# Altium schematic sheet schematic1.SchDoc
size A2; SheetNumber: 5; SheetTotal: 5
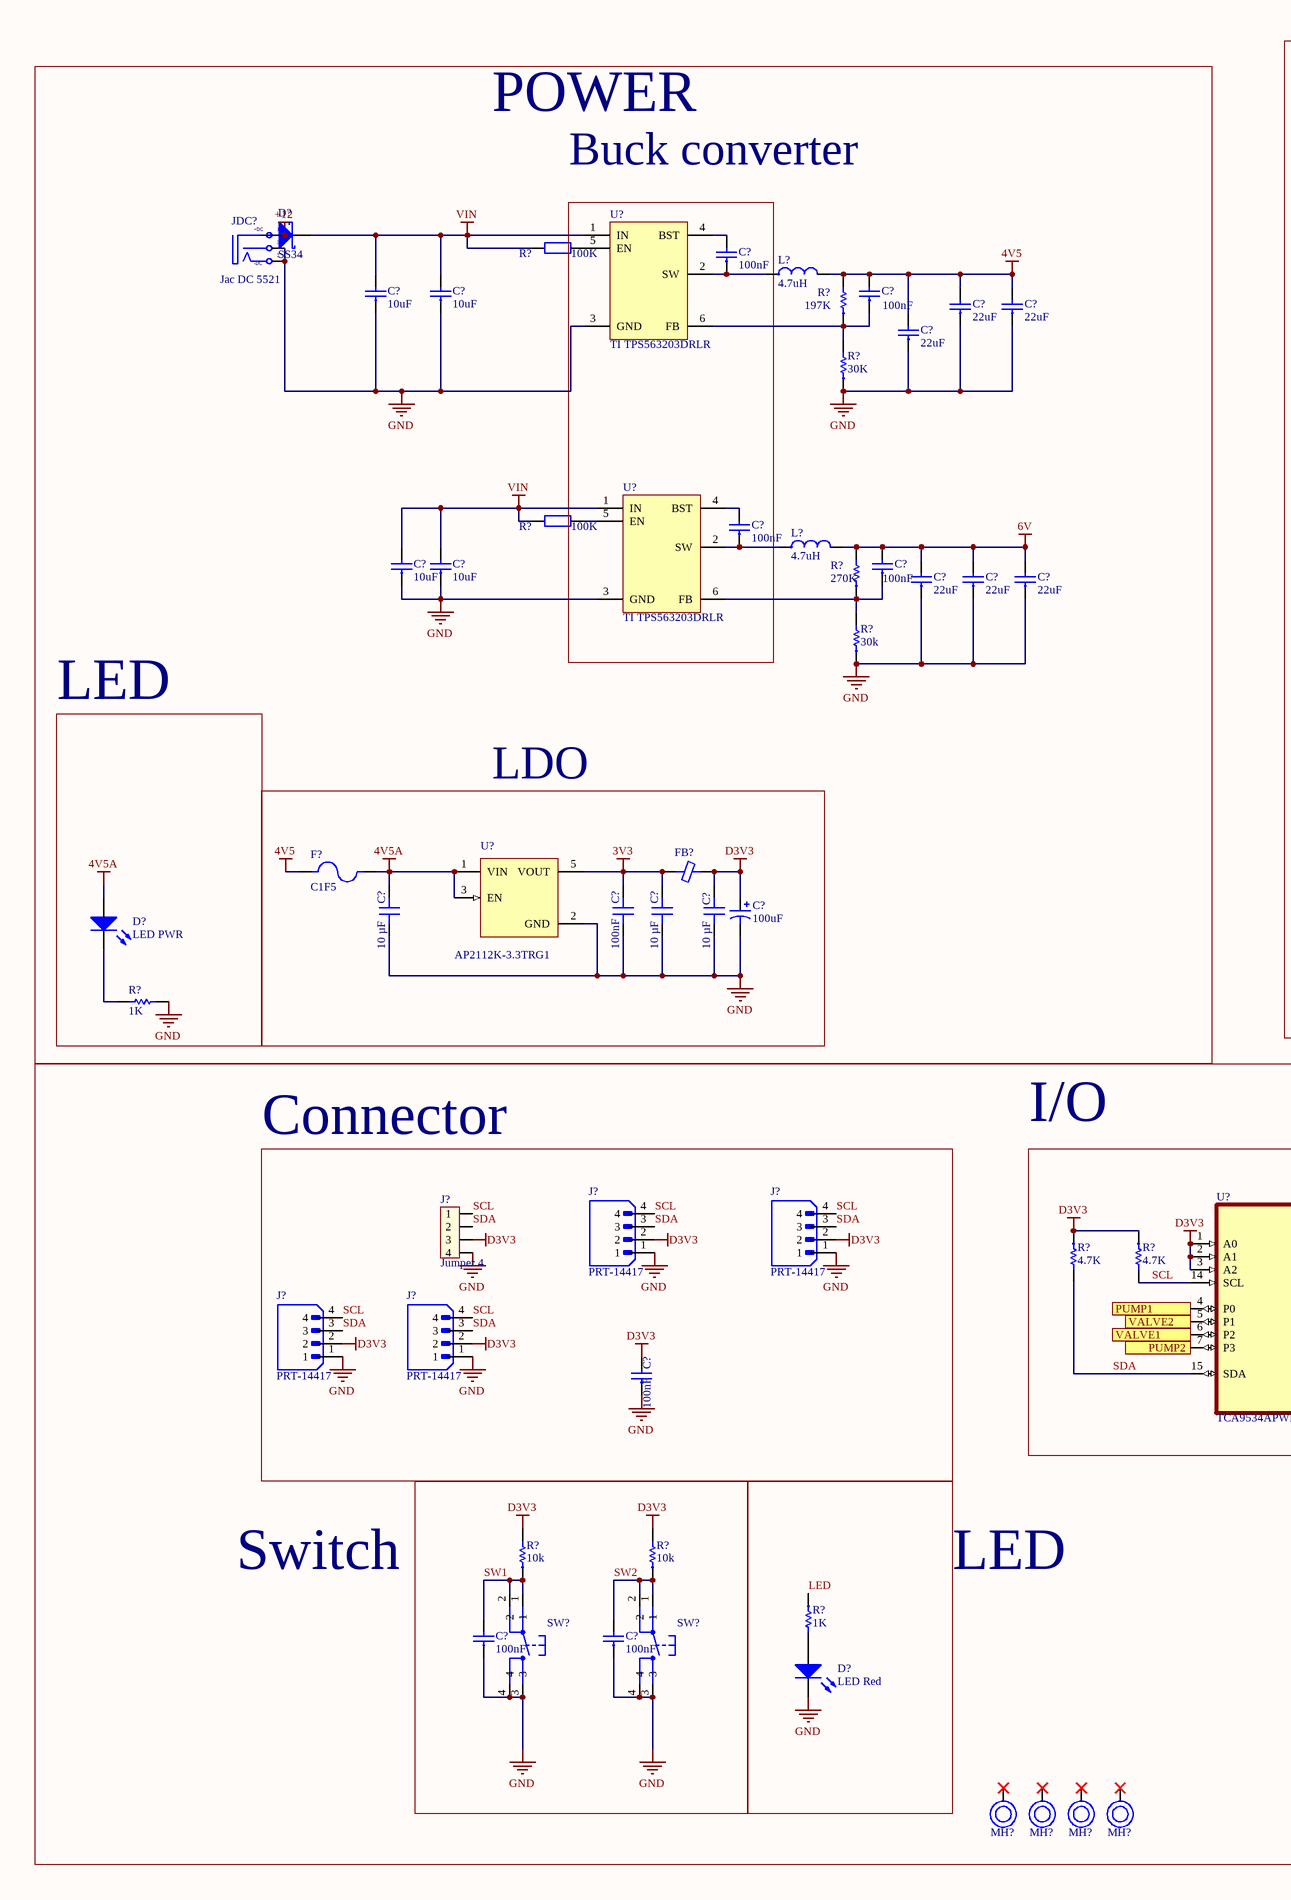
[diagram p0: schematic1.SchDoc, left]
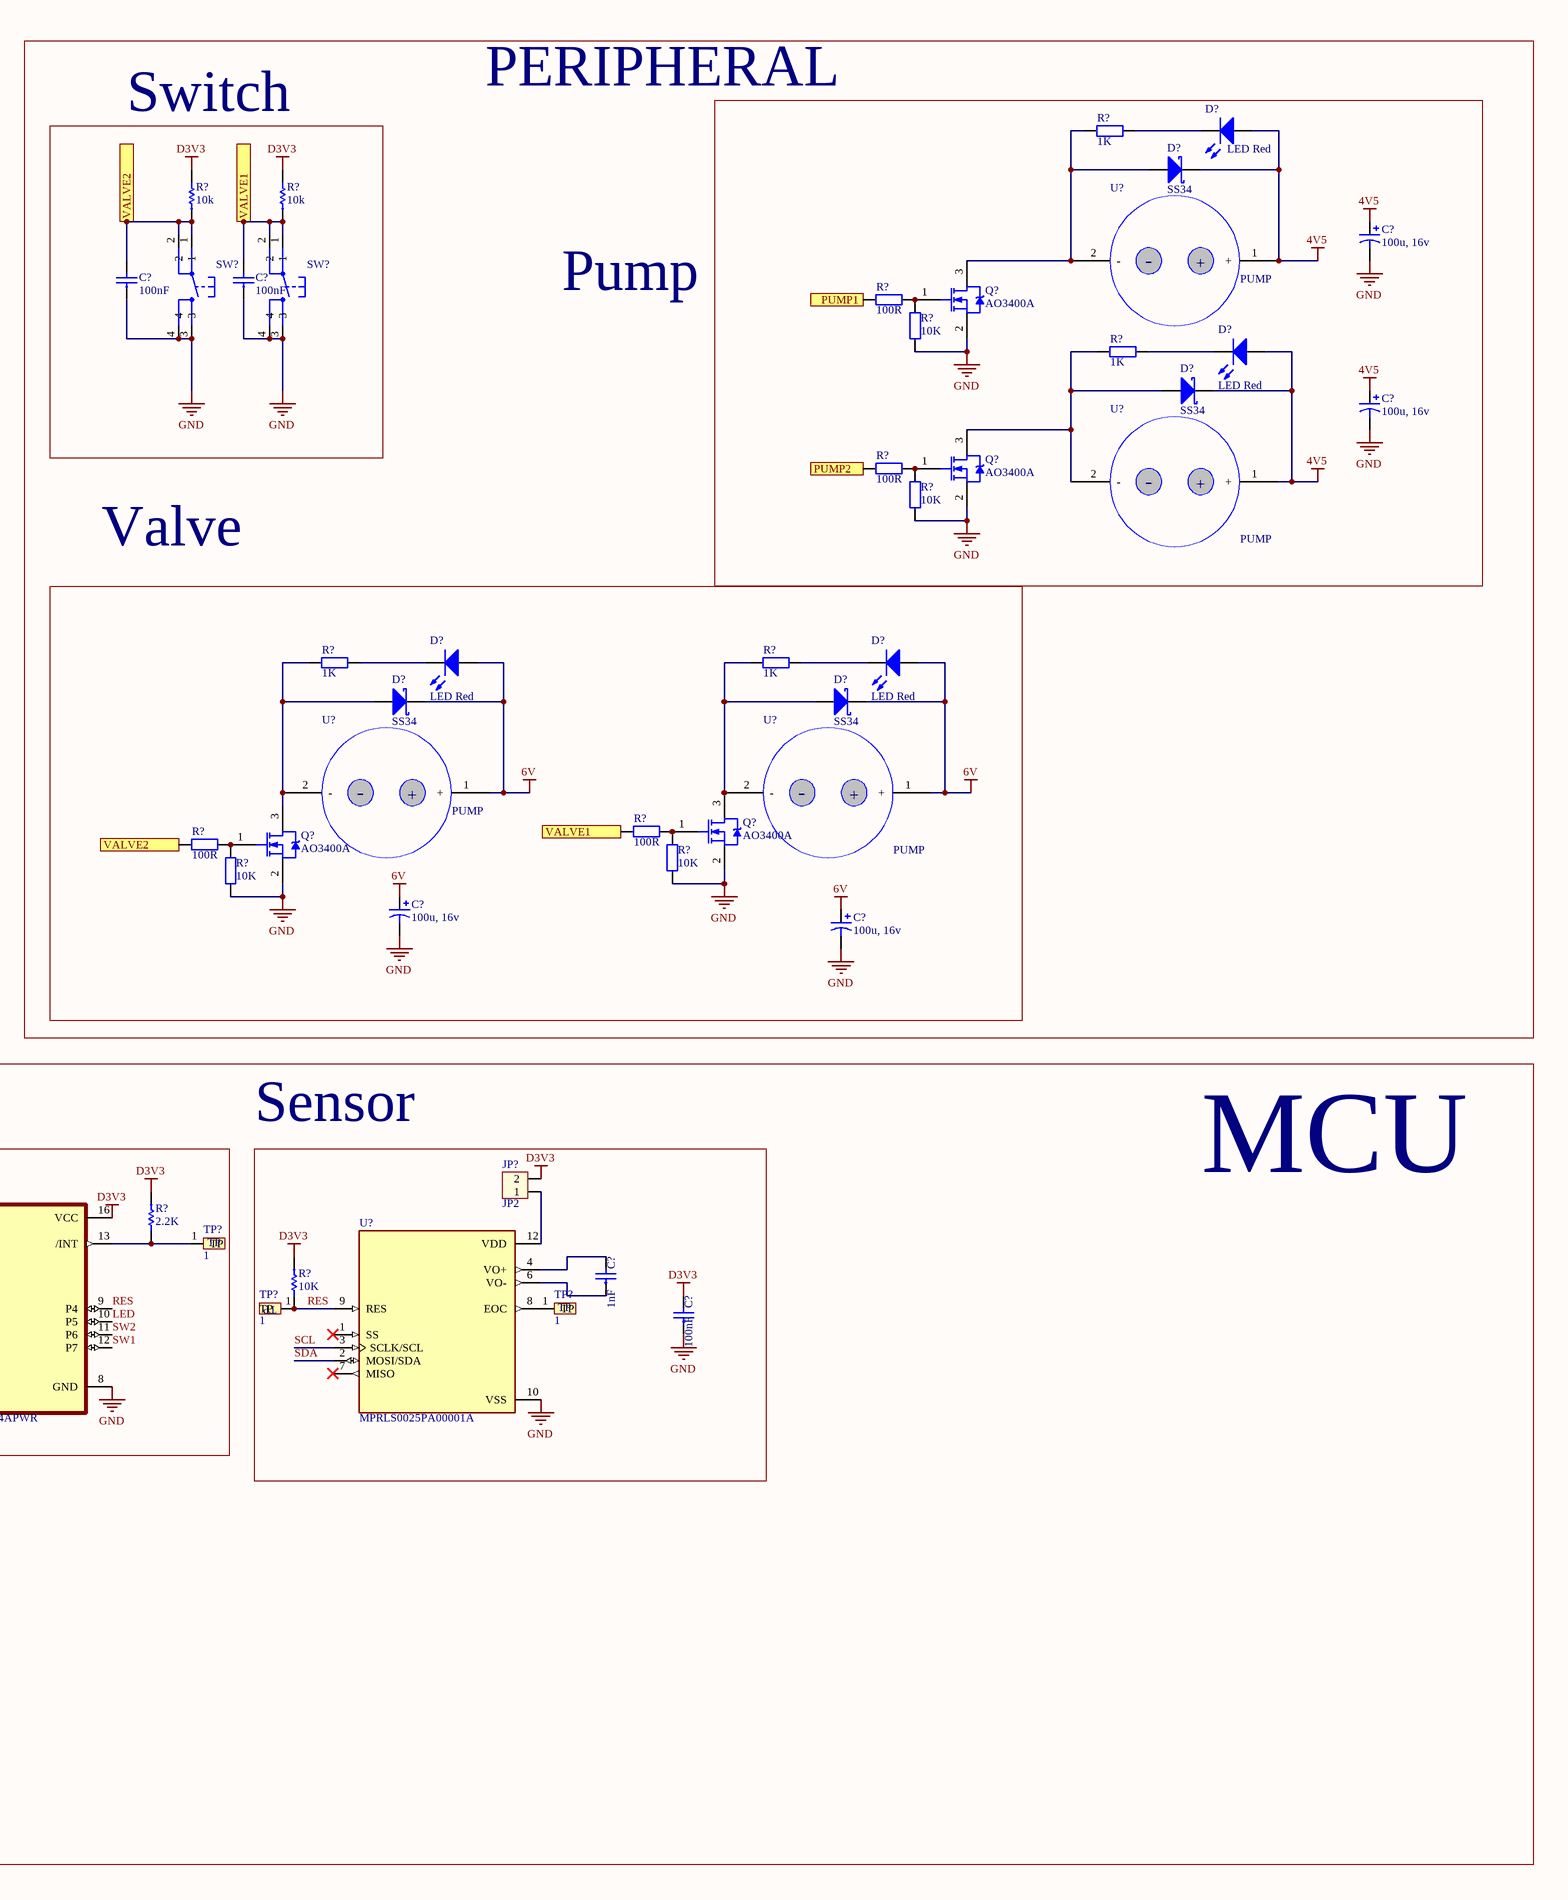
[diagram p1: schematic1.SchDoc, right]

## Parts
(Parts that share a designator on the sheet are numbered #1, #2 ... from top to bottom, then left to right.)
C?#1  value 100u, 16v  [CAPACITOR SIZE_D(D6.6)]  (hidden comment: CAP ALUM 100UF 20% 16V SMD)
C?#2  100nF  [C0603]
C?#3  100nF  [C0603]
C?#4  100nF  [C0603]
C?#5  10uF  [CN-SMD-0603]
C?#6  10uF  [CN-SMD-0603]
C?#7  100nF  [C0603]
C?#8  22uF  [CN-SMD-0603]
C?#9  22uF  [CN-SMD-0603]
C?#10  22uF  [CN-SMD-0603]
C?#11  value 100u, 16v  [CAPACITOR SIZE_D(D6.6)]  (hidden comment: CAP ALUM 100UF 20% 16V SMD)
C?#12  100nF  [C0603]
C?#13  10uF  [CN-SMD-0603]
C?#14  10uF  [CN-SMD-0603]
C?#15  100nF  [C0603]
C?#16  22uF  [CN-SMD-0603]
C?#17  22uF  [CN-SMD-0603]
C?#18  22uF  [CN-SMD-0603]
C?#19  value 100u, 16v  [CAPACITOR SIZE_D(D6.6)]  (hidden comment: CAP ALUM 100UF 20% 16V SMD)
C?#20  10 µF  [C0603]
C?#21  100nF  [C0603]
C?#22  10 µF  [C0603]
C?#23  10 µF  [C0603]
C?#24  value 100uF  [CAPACITOR SIZE_D(D6.6)]  (hidden comment: CAP ALUM 100UF 20% 16V SMD)
C?#25  value 100u, 16v  [CAPACITOR SIZE_D(D6.6)]  (hidden comment: CAP ALUM 100UF 20% 16V SMD)
C?#26  1nF  [C0603]
C?#27  100nF  [C0603]
C?#28  100nF  [C0603]
C?#29  100nF  [C0603]
C?#30  100nF  [C0603]
D?#1  LED Red  [LED0603-R]
D?#2  SS34  [DO-214AC]
D?#3  SS34  [DO-214AC]
D?#4  LED Red  [LED0603-R]
D?#5  SS34  [DO-214AC]
D?#6  LED Red  [LED0603-R]
D?#7  LED Red  [LED0603-R]
D?#8  SS34  [DO-214AC]
D?#9  SS34  [DO-214AC]
D?#10  value LED PWR  [LED0603-R]  (hidden comment: LED Red)
D?#11  LED Red  [LED0603-R]
F?  C1F5  [FUSE C1F5]
FB?  330 Ohms @ 100 MHz  [L0603]  (value not drawn)
J?#1  Jumper 4  [JP4]
J?#2  PRT-14417  [SPARKFUN_PRT-14417]
J?#3  PRT-14417  [SPARKFUN_PRT-14417]
J?#4  PRT-14417  [SPARKFUN_PRT-14417]
J?#5  PRT-14417  [SPARKFUN_PRT-14417]
JDC?  Jac DC 5521  [DC0]
JP?  JP2  [CON2]
L?#1  4.7uH  [IND-0420-2R2]
L?#2  4.7uH  [IND-0420-2R2]
MH?#1  MOUNTING HOLE  [M3]  (value not drawn)
MH?#2  MOUNTING HOLE  [M3]  (value not drawn)
MH?#3  MOUNTING HOLE  [M3]  (value not drawn)
MH?#4  MOUNTING HOLE  [M3]  (value not drawn)
Q?#1  AO3400A  [SOT-23]
Q?#2  AO3400A  [SOT-23]
Q?#3  AO3400A  [SOT-23]
Q?#4  AO3400A  [SOT-23]
R?#1  value 1K  [R0603]  (hidden comment: RES 1K 5% 1/10W 0603)
R?#2  10k  [R0603]
R?#3  10k  [R0603]
R?#4  value 100K  [R0603]  (hidden comment: RES 100K 5% 1/10W 0603)
R?#5  value 100R  [R0603]  (hidden comment: RES 100R 5% 1/10W 0603)
R?#6  197K  [R0603]
R?#7  value 10K  [R0603]  (hidden comment: RES 10K 5% 1/10W 0603)
R?#8  value 1K  [R0603]  (hidden comment: RES 1K 5% 1/10W 0603)
R?#9  30K  [R0603]
R?#10  value 100R  [R0603]  (hidden comment: RES 100R 5% 1/10W 0603)
R?#11  value 10K  [R0603]  (hidden comment: RES 10K 5% 1/10W 0603)
R?#12  value 100K  [R0603]  (hidden comment: RES 100K 5% 1/10W 0603)
R?#13  270K  [R0603]
R?#14  value 1K  [R0603]  (hidden comment: RES 1K 5% 1/10W 0603)
R?#15  value 1K  [R0603]  (hidden comment: RES 1K 5% 1/10W 0603)
R?#16  30k  [R0603]
R?#17  value 100R  [R0603]  (hidden comment: RES 100R 5% 1/10W 0603)
R?#18  value 100R  [R0603]  (hidden comment: RES 100R 5% 1/10W 0603)
R?#19  value 10K  [R0603]  (hidden comment: RES 10K 5% 1/10W 0603)
R?#20  value 10K  [R0603]  (hidden comment: RES 10K 5% 1/10W 0603)
R?#21  1K  [R0603]
R?#22  2.2K  [R0603]
R?#23  4.7K  [R0603]
R?#24  4.7K  [R0603]
R?#25  10K  [R0603]
R?#26  10k  [R0603]
R?#27  10k  [R0603]
R?#28  1K  [R0603]
SW?#1  SW2  [SWITCH]  (value not drawn)
SW?#2  SW2  [SWITCH]  (value not drawn)
SW?#3  SW2  [SWITCH]  (value not drawn)
SW?#4  SW2  [SWITCH]  (value not drawn)
TP?#1  1  [TP]
TP?#2  1  [TP]
TP?#3  1  [TP]
U?#1  TI TPS563203DRLR  [SOT50P160X60-6N]
U?#2  PUMP  [Pump]
U?#3  PUMP  [Pump]
U?#4  TI TPS563203DRLR  [SOT50P160X60-6N]
U?#5  PUMP  [Pump]
U?#6  PUMP  [Pump]
U?#7  AP2112K-3.3TRG1  [SOT-23-5]
U?#8  TCA9534APWR  [SOP65P640X120-16N]
U?#9  MPRLS0025PA00001A  [XDCR_MPRLS0025PA00001A]

## Sub-sheets
Buck converter = File Name: no entries
Connector = File Name: no entries
I/O = File Name: no entries
LDO = File Name: no entries
LED = File Name: no entries
LED = File Name: no entries
MCU = File Name: no entries
PERIPHERAL = File Name: no entries
POWER = File Name: no entries
Pump = File Name: no entries
Sensor = File Name: no entries
Switch = File Name: no entries
Switch = File Name: no entries
Valve = File Name: no entries

## Ports
PUMP1 (in), PUMP1 (out), PUMP2 (in), PUMP2 (out), VALVE1 (in), VALVE1 (out), VALVE2 (in), VALVE2 (out)

## Nets
3V3: C?#21.2 C?#22.2 FB?.1 U?#7.5(VOUT)
4V5: C?#1.1 C?#7.2 C?#8.2 C?#9.2 C?#10.2 C?#11.1 D?#1.1(A) D?#2.2(K) D?#4.1(A) D?#5.2(K) F?.1 L?#1.2 R?#6.2 U?#2.1(+) U?#3.1(+)
4V5A: C?#20.2 D?#10.1(A) F?.2 U?#7.1(VIN) U?#7.3(EN)
6V: C?#15.2 C?#16.2 C?#17.2 C?#18.2 C?#19.1 C?#25.1 D?#6.1(A) D?#7.1(A) D?#8.2(K) D?#9.2(K) L?#2.2 R?#13.2 U?#5.1(+) U?#6.1(+)
+12: D?#3.1(A) JDC?.1(T)
D3V3: C?#23.2 C?#24.1 C?#27.2 C?#28.2 FB?.2 J?#1.3 J?#2.2 J?#3.2 J?#4.2 J?#5.2 JP?.2 R?#2.2 R?#3.2 R?#22.1 R?#23.1 R?#24.1 R?#25.1 R?#26.2 R?#27.2 U?#8.1(A0) U?#8.2(A1) U?#8.3(A2) U?#8.16(VCC)
GND: C?#1.2 C?#3.1 C?#4.1 C?#5.1 C?#6.1 C?#8.1 C?#9.1 C?#10.1 C?#11.2 C?#13.1 C?#14.1 C?#16.1 C?#17.1 C?#18.1 C?#19.2 C?#20.1 C?#21.1 C?#22.1 C?#23.1 C?#24.2 C?#25.2 C?#27.1 C?#28.1 C?#29.1 C?#30.1 D?#11.2(K) J?#1.4 J?#2.1 J?#3.1 J?#4.1 J?#5.1 JDC?.2(TN) JDC?.3(S) Q?#1.2(S) Q?#2.2(S) Q?#3.2(S) Q?#4.2(S) R?#7.1 R?#9.1 R?#11.1 R?#16.1 R?#19.1 R?#20.1 R?#21.2 SW?#1.3 SW?#1.4 SW?#2.3 SW?#2.4 SW?#3.3 SW?#3.4 SW?#4.3 SW?#4.4 U?#1.3(GND) U?#4.3(GND) U?#7.2(GND) U?#8.8(GND) U?#9.10(VSS)
VIN: C?#5.2 C?#6.2 C?#13.2 C?#14.2 D?#3.2(K) R?#4.2 R?#12.2 U?#1.1(IN) U?#4.1(IN)
LED: R?#28.1 U?#8.10(P5)
PUMP1: R?#5.1 U?#8.4(P0) ; port PUMP1
PUMP2: R?#10.1 U?#8.7(P3) ; port PUMP2
RES: R?#25.2 TP?#2.1(TP) U?#8.9(P4) U?#9.9(RES)
SCL: J?#1.1 J?#2.4 J?#3.4 J?#4.4 J?#5.4 R?#24.2 U?#8.14(SCL) U?#9.3(SCLK/SCL)
SDA: J?#1.2 J?#2.3 J?#3.3 J?#4.3 J?#5.3 R?#23.2 U?#8.15(SDA) U?#9.2(MOSI/SDA)
SW1: C?#29.2 R?#26.1 SW?#3.1 SW?#3.2 U?#8.12(P7)
SW2: C?#30.2 R?#27.1 SW?#4.1 SW?#4.2 U?#8.11(P6)
VALVE1: C?#4.2 R?#3.1 R?#17.1 SW?#2.1 SW?#2.2 U?#8.6(P2) ; port VALVE1
VALVE2: C?#3.2 R?#2.1 R?#18.1 SW?#1.1 SW?#1.2 U?#8.5(P1) ; port VALVE2
NetC?#2_1: C?#2.1 L?#1.1 U?#1.2(SW)
NetC?#2_2: C?#2.2 U?#1.4(BST)
NetC?#7_1: C?#7.1 R?#6.1 R?#9.2 U?#1.6(FB)
NetC?#12_1: C?#12.1 L?#2.1 U?#4.2(SW)
NetC?#12_2: C?#12.2 U?#4.4(BST)
NetC?#15_1: C?#15.1 R?#13.1 R?#16.2 U?#4.6(FB)
NetC?#26_1: C?#26.1 U?#9.6(VO-)
NetC?#26_2: C?#26.2 U?#9.4(VO+)
NetD?#1_2: D?#1.2(K) R?#1.2
NetD?#2_1: D?#2.1(A) Q?#1.3(D) R?#1.1 U?#2.2(-)
NetD?#4_2: D?#4.2(K) R?#8.2
NetD?#5_1: D?#5.1(A) Q?#2.3(D) R?#8.1 U?#3.2(-)
NetD?#6_2: D?#6.2(K) R?#14.2
NetD?#7_2: D?#7.2(K) R?#15.2
NetD?#8_1: D?#8.1(A) Q?#4.3(D) R?#14.1 U?#5.2(-)
NetD?#9_1: D?#9.1(A) Q?#3.3(D) R?#15.1 U?#6.2(-)
NetD?#10_2: D?#10.2(K) R?#21.1
NetD?#11_1: D?#11.1(A) R?#28.2
NetJP?_1: JP?.1 U?#9.12(VDD)
NetQ?#1_1: Q?#1.1(G) R?#5.2 R?#7.2
NetQ?#2_1: Q?#2.1(G) R?#10.2 R?#11.2
NetQ?#3_1: Q?#3.1(G) R?#17.2 R?#19.2
NetQ?#4_1: Q?#4.1(G) R?#18.2 R?#20.2
NetR?#4_1: R?#4.1 U?#1.5(EN)
NetR?#12_1: R?#12.1 U?#4.5(EN)
NetR?#22_2: R?#22.2 TP?#1.1(TP) U?#8.13(/INT)
NetTP?#3_1: TP?#3.1(TP) U?#9.8(EOC)

Not connected (* = marked no-connect by the designer): MH?#1 1(GND)*; MH?#2 1(GND)*; MH?#3 1(GND)*; MH?#4 1(GND)*; U?#9 1(SS)* 7(MISO)*

## Notes on the sheet
- (in symbol DCIN) +DC; -DC

## Library data of the parts
C?#1 C?#11 C?#19 C?#24 C?#25 = UWT1C101MCL1GB: Nichicon Aluminum Cap 220uF 10V 20%; Supplier 1: Digi-Key; Supplier Part Number 1: 493-2177-2-ND
C?#2 C?#12 = CAPCER0001 100nF 10% 50V X7R 0603 SMD_1: CAP CER 100nF 10% 50V X7R 0603 SMD; LINE: SMT; TYPE: EP; UNIT: PCS; TMG CODE: None; CERTIFICATION: NA; CLASS: B; MOUNT: SMD; TMG PN: CAPCER0001; ComponentLink1Description: Datasheet; ComponentLink1URL: https://datasheet.lcsc.com/lcsc/1811021431_Samsung-Electro-Mechanics-CL10B104KB8NNNC_C1591.pdf; Footprint: 0603
C?#3 C?#4 C?#7 C?#15 C?#26-C?#30 = CAPCER0001 100nF 10% 50V X7R 0603 SMD: CAP CER 100nF 10% 50V X7R 0603 SMD; LINE: SMT; TYPE: EP; UNIT: PCS; TMG CODE: None; CERTIFICATION: NA; CLASS: B; MOUNT: SMD; TMG PN: CAPCER0001; ComponentLink1Description: Datasheet; ComponentLink1URL: https://datasheet.lcsc.com/lcsc/1811021431_Samsung-Electro-Mechanics-CL10B104KB8NNNC_C1591.pdf; Footprint: 0603
C?#5 C?#6 C?#8-C?#10 C?#13 C?#14 C?#16-C?#18 = CAPCER0040 10uF 20% 6.3V X5R 0402 SMD: CAP CER 10uF 20% 6.3V X5R 0402 SMD; LINE: SMT; TYPE: EP; UNIT: PCS; TMG PN: CAPCER0013; TMG CODE: None; CERTIFICATION: NA; CLASS: B; MOUNT: SMD; ComponentLink1Description: Datasheet; ComponentLink1URL: https://datasheet.lcsc.com/lcsc/2304140030_YAGEO-CC0402MRX5R5BB106_C105884.pdf; Footprint: 0402
C?#20 C?#22 C?#23 = GMC10X7R106K10NT: CAP0603 X7R 10UF 10% 10V; manufacturer: Cal-Chip Electronics, Inc.; Part Number: GMC10X7R106K10NT; Value: 10 µF; Applications: General Purpose; Capacitance: 10 µF; componentlink1description: Datasheet; componentlink1url: https://88ce57.p3cdn1.secureserver.net/wp-content/uploads/2023/01/gmc_series-2.pdf; componentlink2description: DigiKey Link; componentlink2url: https://www.digikey.com/en/products/detail/cal-chip-electronics-inc/GMC10X7R106K10NT/18151126; Device Package: 0603 (1608 Metric); lastupdated: 2/9/2024 8:09:39 PM; Lifecycle Status: Active; Minimum Order: 1; Mounting Type: Surface Mount, MLCC; Operating Temperature: -55°C ~ 125°C; Package / Case: 0603 (1608 Metric); packaging: TapeAndReel; partid: 49835; Part Status: Active; price: 0.26; series: GMC; Size / Dimension: 0.063" L x 0.031" W (1.60mm x 0.80mm); Supplier 1: DigiKey; Supplier Part Number 1: 4713-GMC10X7R106K10NTCT-ND; Temperature Coefficient: X7R; Thickness (Max): 0.039" (1.00mm); Tolerance: ±10%; Voltage - Rated: 10V
C?#21 = GMC10X7R106K10NT: CAP0603 X7R 10UF 10% 10V; manufacturer: Cal-Chip Electronics, Inc.; Capacitance: 10 µF; Part Number: GMC10X7R106K10NT; Value: 100nF; Applications: General Purpose; componentlink1description: Datasheet; componentlink1url: https://88ce57.p3cdn1.secureserver.net/wp-content/uploads/2023/01/gmc_series-2.pdf; componentlink2description: DigiKey Link; componentlink2url: https://www.digikey.com/en/products/detail/cal-chip-electronics-inc/GMC10X7R106K10NT/18151126; Device Package: 0603 (1608 Metric); lastupdated: 2/9/2024 8:09:39 PM; Lifecycle Status: Active; Minimum Order: 1; Mounting Type: Surface Mount, MLCC; Operating Temperature: -55°C ~ 125°C; Package / Case: 0603 (1608 Metric); packaging: TapeAndReel; partid: 49835; Part Status: Active; price: 0.26; series: GMC; Size / Dimension: 0.063" L x 0.031" W (1.60mm x 0.80mm); Supplier 1: DigiKey; Supplier Part Number 1: 4713-GMC10X7R106K10NTCT-ND; Temperature Coefficient: X7R; Thickness (Max): 0.039" (1.00mm); Tolerance: ±10%; Voltage - Rated: 10V
D?#1 D?#4 D?#6 D?#7 D?#10 D?#11 = LTST-C190KRKT: Lite-On LED Red 0603; Supplier Part Number 1: 160-1436-1-ND; Supplier 1: Digi-Key; Supplier Part Number 2: FL1413
  D?#1 D?#4 D?#6 D?#7 D?#11: Value: LED Red
D?#2 D?#3 D?#5 D?#8 D?#9 = SS34: Schottky Diode 40V 3A SMA; Supplier 1: Digi-Key; Supplier Part Number 1: SS34-E3/57TGICT-ND; Value: SS34
F? = C1F5: Fuse Chip Fast Acting 5A 125V SMD Solder Pad 1206 3.2 X 1.58 X 0.63mm; Manufacturer: Bel TRP; Voltage Rating (DC): 63V; DC Cold Resistance: 20mR; Fuse Type: Board Mount (Cartridge Style Excluded); Supplier 1: Newark; Manufacturer Part Number: C1F5; RoHS: Yes; Category: Uncategorized; Mount: Surface Mount; Case/Package: 1206; Number of Pins: 2; Contact Plating: Tin; Case Code (Metric): 3216; Case Code (Imperial): 1206; Min Operating Temperature: -55°C; Max Operating Temperature: 125°C; Packaging: Cut Tape; Voltage Rating: 125V; Series: C1F; Voltage Rating (AC): 125V; ComponentLink1URL: http://www.mouser.com/ds/2/643/C1F-594910.pdf?src-supplier=Mouser; ComponentLink1Description: http://www.mouser.com/ds/2/643/C1F-594910.pdf?src-supplier=Mouser; ComponentLink2URL: http://belfuse.com/pdfs/C1F.pdf?src-supplier=Avnet; ComponentLink2Description: http://belfuse.com/pdfs/C1F.pdf?src-supplier=Avnet; ComponentLink3URL: https://belfuse.com/resources/datasheets/circuitprotection/ds-cp-c1f-series.pdf?src-supplier=Digikey; ComponentLink3Description: https://belfuse.com/resources/datasheets/circuitprotection/ds-cp-c1f-series.pdf?src-supplier=Digikey; Supplier Part Number 1: 48AC8480
FB? = BLM18KG331SH1D: FERRITE BEAD 330 OHM 0603 1LN; Manufacturer: Murata Electronics; Current Rating (Max): 1.7A; DC Resistance (DCR) (Max): 80mOhm; Filter Type: Power Line; Number of Lines: 1; Part Number: BLM18KG331SH1D; ComponentLink1Description: Datasheet; ComponentLink1URL: https://www.murata.com/en-global/products/productdata/8796737273886/QNFA9101.pdf; ComponentLink2Description: DigiKey Link; ComponentLink2URL: https://www.digikey.com/en/products/detail/murata-electronics/BLM18KG331SH1D/5881246; Device Package: 0603 (1608 Metric); Height (Max): 0.037" (0.95mm); Impedance @ Frequency: 330 Ohms @ 100 MHz; LastUpdated: 3/11/2024 7:43:28 AM; Lifecycle Status: Active; Minimum Order: 1; Mounting Type: Surface Mount; Operating Temperature: -55°C ~ 125°C; Package / Case: 0603 (1608 Metric); Packaging: TapeAndReel; PartId: 932; Part Status: Active; Price: 0.02; Ratings: AEC-Q200; Series: EMIFIL®, BLM18; Size / Dimension: 0.063" L x 0.032" W (1.60mm x 0.80mm); Supplier 1: DigiKey; Supplier Part Number 1: 490-13257-1-ND; Value: 330 Ohms @ 100 MHz
J?#1 = JP4: Jumper 3; Value: J3
J?#2-J?#5 = PRT-14417: QWIIC JST CONNECTOR - SMD 4-PIN; MF: SparkFun Electronics; SnapEDA_Link: https://www.snapeda.com/parts/PRT-14417/SparkFun+Electronics/view-part/?ref=snap; Package: None; Value: *; MP: PRT-14417; Check_prices: https://www.snapeda.com/parts/PRT-14417/SparkFun+Electronics/view-part/?ref=eda
JDC? = DCIN: Jac DC input; Value: Jac DC
JP? = Con2: Connector 2; Value: Connector 2
L?#1 L?#2 = INDMOI0016 1W2T 2.2uH 20% 5A 0420 SMD: IND MOI 1W2T 2.2uH 20% 5A 0420 SMD; LINE: SMT; TYPE: EP; UNIT: PCS; TMG CODE: None; CERTIFICATION: NA; CLASS: B; MOUNT: SMD; ComponentLink1Description: Datasheet; ComponentLink1URL: https://datasheet.lcsc.com/lcsc/2305161117_cjiang--Changjiang-Microelectronics-Tech-FXL0420-2R2-M_C167206.pdf
MH?#1-MH?#4 = MH
Q?#1-Q?#4 = IRFML8244TRPBF: MOSFET N-CH 25V 5.8A SOT23; Supplier 1: Digi-Key; Supplier Part Number 1: IRFML8244TRPBFCT-ND; Value: AO3400A
R?#1 R?#8 R?#14 R?#15 = RC0603JR-071KL: Yageo RES 1K 5% 1/10W 0603; Supplier 1: LCSC; Supplier Part Number 1: C131707
R?#2 R?#3 R?#22-R?#28 = RESCHP0428 8K4 1% 0603 SMD: RES CHP 8K4 1% 1/10W 0603 SMD; LINE: SMT; UNIT: PCS; TMG CODE: None; CERTIFICATION: NA; CLASS: B; MOUNT: SMD; TYPE: EP; ComponentLink1Description: Datasheet; ComponentLink1URL: https://datasheet.lcsc.com/lcsc/2304140030_YAGEO-RT0603FRD07100RL_C160603.pdf
R?#4 R?#12 = RC0603JR-07100KL: Yageo RES 100K 5% 1/10W 0603; Supplier 1: Digi-Key; Supplier Part Number 1: 311-100KGRCT-ND; Supplier Part Number 2: FL2402
R?#5 R?#10 R?#17 R?#18 = RC0603JR-07100RL: Yageo RES 100R 5% 1/10W 0603; Supplier 1: Digi-Key; Supplier Part Number 1: 311-100GRCT-ND; Supplier Part Number 2: FL2438
R?#6 R?#9 R?#13 R?#16 = RESCHP0195 2K7 1% 0603 SMD: RES CHP 2K7 1% 1/10W 0603 SMD; LINE: SMT; UNIT: PCS; TMG CODE: None; CERTIFICATION: NA; CLASS: B; MOUNT: SMD; TYPE: EP; TMG PN: RESCHP0195; ComponentLink1Description: Datasheet; ComponentLink1URL: https://datasheet.lcsc.com/lcsc/2304140030_YAGEO-RC0603FR-072K7L_C114612.pdf; Footprint: 0603
R?#7 R?#11 R?#19 R?#20 = RC0603JR-0710KL: Yageo RES 10K 5% 1/10W 0603; Supplier 1: Digi-Key; Supplier Part Number 1: 311-10KGRCT-ND; Supplier Part Number 2: FL2403
R?#21 = Resistor 2.2K: Res Thick Film 0603 2.2K Ohm 5% 1/10W ±200ppm/°C Molded SMD SMD Paper T/R; Manufacturer: Vishay; Manufacturer Part Number: CRCW06032K20JNEA; Resistance: 2.2kR; Power Rating: 100mW; Voltage Rating: 75V; Value: 2.2kR; Supplier 1: Arrow Electronics; RoHS: Yes; Category: Chip SMD Resistors; Stock 1: 130000; Pricing 1: 5000=0.0053 (USD); Case/Package: 0603; Weight: 7.1E-05oz; Case Code (Metric): 1608; Case Code (Imperial): 0603; Contact Plating: Tin; Size Code: 0603; Min Operating Temperature: -55°C; Max Operating Temperature: 155°C; Package Quantity: 5000; Tolerance: 5%; Packaging: Tape and Reel; Resistor Type: Thick Film; Number of Terminations: 2; Temperature Coefficient: 200ppm/°C; Termination: SMD/SMT; Max Power Dissipation: 100mW; Features: Automotive AEC-Q200; Series: CRCW; Resistance Tolerance: 5%; Construction: Rectangular; Length: 1.55mm; Width: 0.85mm; Height: 0.45mm; Depth: 0.85mm; Ratings: AEC-Q200; Radiation Hardening: No; Military Standard: Not; RoHS Compliant: Yes; Reach SVHC Compliant: Unknown; Lead Free: 5697LeadFree; ComponentLink1URL: https://datasheet.ciiva.com/2462/dcrcwe3-2462048.pdf?src-supplier=Digikey; ComponentLink1Description: https://datasheet.ciiva.com/2462/dcrcwe3-2462048.pdf?src-supplier=Digikey; ComponentLink2URL: https://datasheet.ciiva.com/16767/70201119-16767464.pdf?src-supplier=Allied+Electronics; ComponentLink2Description: https://datasheet.ciiva.com/16767/70201119-16767464.pdf?src-supplier=Allied+Electronics; ComponentLink3URL: https://datasheet.ciiva.com/2462/dcrcwe3-2462046.pdf?src-supplier=Digikey; ComponentLink3Description: https://datasheet.ciiva.com/2462/dcrcwe3-2462046.pdf?src-supplier=Digikey; ComponentLink4URL: https://datasheet.ciiva.com/5541/dcrcwe3-109170-5541959.pdf?src-supplier=Mouser; ComponentLink4Description: https://datasheet.ciiva.com/5541/dcrcwe3-109170-5541959.pdf?src-supplier=Mouser; ComponentLink5URL: https://datasheet.ciiva.com/16286/dcrcwe3-16286997.pdf?src-supplier=Future+Electronics; ComponentLink5Description: https://datasheet.ciiva.com/16286/dcrcwe3-16286997.pdf?src-supplier=Future+Electronics; Supplier Part Number 1: CRCW06032K20JNEA
SW?#1-SW?#4 = SW2: Switch button 4 pin
TP?#1-TP?#3 = TP: CONNECT 1
U?#1 U?#4 = ICSOCV0021 BCK TPS563201 3A SOT23-6 SMD: ICS OCV BCK TPS563201 3A SOT23-6 SMD; LINE: SMT; UNIT: PCS; TMG CODE: None; CERTIFICATION: NA; CLASS: B; MOUNT: SMD; TYPE: EP; ComponentLink1Description: Datasheet; ComponentLink1URL: https://datasheet.lcsc.com/lcsc/2304241919_Texas-Instruments-TPS563201DDCR_C116592.pdf
U?#2 U?#3 U?#5 U?#6 = A5F083: Connector Header 2 Position 6.35mm Solder Straight Thru-Hole 2 Terminal 1 Port MLX-Series; Manufacturer: Molex; Manufacturer Lifecycle Status: ACTIVE; Connector Type: Power; Contact Resistance: 3.5mΩ; Current Rating: 13.5A; Dielectric Material: Polyester; Gender: Female; Glow Wire Compliant: Non-compliant; Insulation Resistance: 1GΩ; Number of Circuits: 2; Operating Force: 6.672N; Plating: Tin; Plating Thickness: 3.5052µm; Voltage Rating: 600V; Supplier 1: Arrow Electronics; Manufacturer Part Number: 10-84-4022; RoHS: Compliant; Category: Headers and Wire Housings; Stock 1: 4724; Pricing 1: 1=0,2907, 10=0,267, 100=0,245, 500=0,229, 1836=0,216 (USD); China RoHS: Compliant; Color: Natural; Contact Gender: Female; Contact Material: Bronze; Contact Plating: Tin; Country of Origin: US; Flammability Rating: UL94 V-2; Halogen Free: Low Halogen; Housing Material: Nylon; Lead Free: Lead Free; Lifecycle Status: Production; Max Operating Temperature: 105°C; Min Operating Temperature: -55°C; Mount: Through Hole; Number of Contacts: 2; Number of Pins: 2; Number of Positions: 2; Number of Rows: 1; Orientation: Vertical; Packaging: Carton; Pitch: 6.35mm; Radiation Hardening: No; REACH SVHC: Yes; Schedule B: 8536694040, 8536694040|8536694040|8536694040|8536694040|8536694040; Shell Material: POLYAMIDE66; Terminal Pitch: 6.35mm; Termination: Solder; ComponentLink1URL: https://datasheet.octopart.com:443/10-84-4022-Molex-datasheet-137053637.pdf?src-supplier=element14+APAC; ComponentLink1Description: https://datasheet.octopart.com:443/10-84-4022-Molex-datasheet-137053637.pdf?src-supplier=element14+APAC; ComponentLink2URL: https://datasheet.octopart.com:443/10-84-4022-Molex-datasheet-13791970.pdf?src-supplier=Molex; ComponentLink2Description: https://datasheet.octopart.com:443/10-84-4022-Molex-datasheet-13791970.pdf?src-supplier=Molex; ComponentLink3URL: https://sigma.octopart.com:443/16272272/technical_drawing/Molex-10-84-4022.pdf?src-supplier=Molex; ComponentLink3Description: https://sigma.octopart.com:443/16272272/technical_drawing/Molex-10-84-4022.pdf?src-supplier=Molex; ComponentLink4URL: https://datasheet.octopart.com:443/010844022-Molex-datasheet-5390850.pdf?src-supplier=Molex; ComponentLink4Description: https://datasheet.octopart.com:443/010844022-Molex-datasheet-5390850.pdf?src-supplier=Molex; ComponentLink5URL: https://datasheet.octopart.com:443/10-84-4022-Molex-datasheet-154742841.pdf?src-supplier=Master+Electronics; ComponentLink5Description: https://datasheet.octopart.com:443/10-84-4022-Molex-datasheet-154742841.pdf?src-supplier=Master+Electronics; ComponentLink6URL: https://datasheet.octopart.com:443/10-84-4022-Molex-datasheet-33343972.pdf?src-supplier=Electro+Sonic; ComponentLink6Description: https://datasheet.octopart.com:443/10-84-4022-Molex-datasheet-33343972.pdf?src-supplier=Electro+Sonic; ComponentLink7URL: https://datasheet.octopart.com:443/10-84-4022-Molex-datasheet-21205596.pdf?src-supplier=Electro+Sonic; ComponentLink7Description: https://datasheet.octopart.com:443/10-84-4022-Molex-datasheet-21205596.pdf?src-supplier=Electro+Sonic; ComponentLink8URL: https://datasheet.octopart.com:443/10-84-4022-Molex-datasheet-62102692.pdf?src-supplier=Electro+Sonic; ComponentLink8Description: https://datasheet.octopart.com:443/10-84-4022-Molex-datasheet-62102692.pdf?src-supplier=Electro+Sonic; ComponentLink9URL: https://datasheet.octopart.com:443/10-84-4022-Molex-datasheet-140174504.pdf?src-supplier=RS+(Formerly+Allied+Electronics); ComponentLink9Description: https://datasheet.octopart.com:443/10-84-4022-Molex-datasheet-140174504.pdf?src-supplier=RS+(Formerly+Allied+Electronics); ComponentLink10URL: https://datasheet.octopart.com:443/10-84-4022-Molex-datasheet-120134962.pdf?src-supplier=RS+(Formerly+Allied+Electronics); ComponentLink10Description: https://datasheet.octopart.com:443/10-84-4022-Molex-datasheet-120134962.pdf?src-supplier=RS+(Formerly+Allied+Electronics); ComponentLink11URL: https://datasheet.octopart.com:443/10-84-4022-Molex-datasheet-32867450.pdf?src-supplier=Newark; ComponentLink11Description: https://datasheet.octopart.com:443/10-84-4022-Molex-datasheet-32867450.pdf?src-supplier=Newark; ComponentLink12URL: https://datasheet.octopart.com:443/10844022-Molex-datasheet-8320017.pdf?src-supplier=Jameco; ComponentLink12Description: https://datasheet.octopart.com:443/10844022-Molex-datasheet-8320017.pdf?src-supplier=Jameco; ComponentLink13URL: https://datasheet.octopart.com:443/10-84-4022-Molex-datasheet-5314522.pdf?src-supplier=Verical; ComponentLink13Description: https://datasheet.octopart.com:443/10-84-4022-Molex-datasheet-5314522.pdf?src-supplier=Verical; ComponentLink14URL: https://datasheet.octopart.com:443/10-84-4022-Molex-datasheet-27226.pdf?src-supplier=DigiKey; ComponentLink14Description: https://datasheet.octopart.com:443/10-84-4022-Molex-datasheet-27226.pdf?src-supplier=DigiKey; ComponentLink15URL: http://sigma.octopart.com:80/16272275/rohs_statement/Molex-10-84-4022.pdf?src-supplier=Compliance+Statements; ComponentLink15Description: http://sigma.octopart.com:80/16272275/rohs_statement/Molex-10-84-4022.pdf?src-supplier=Compliance+Statements; ComponentLink16URL: http://sigma.octopart.com:80/reach_statement/Molex-company-74.pdf?src-supplier=Compliance+Statements; ComponentLink16Description: http://sigma.octopart.com:80/reach_statement/Molex-company-74.pdf?src-supplier=Compliance+Statements; ComponentLink17URL: http://sigma.octopart.com:80/rohs_statement/Molex-company-73.pdf?src-supplier=Compliance+Statements; ComponentLink17Description: http://sigma.octopart.com:80/rohs_statement/Molex-company-73.pdf?src-supplier=Compliance+Statements; ComponentLink18URL: http://sigma.octopart.com:80/conflict_mineral_statement/Molex-company-72.pdf?src-supplier=Compliance+Statements; ComponentLink18Description: http://sigma.octopart.com:80/conflict_mineral_statement/Molex-company-72.pdf?src-supplier=Compliance+Statements; Supplier Part Number 1: 0010844022
U?#7 = AP2112K-3.3TRG1: AP2112 Series 0.6 A 3.3 V Fixed Output SMT LDO Linear Regulator - SOT23-5; MF: Diodes Inc.; Value: 1K; Availability: Unavailable; Package: SOT-753 Diodes Inc.; Price: None; SnapEDA_Link: https://www.snapeda.com/parts/AP2112K-3.3TRG1/Diodes%20Inc./view-part/?ref=snap; MP: AP2112K-3.3TRG1
U?#8 = TCA9534APWR: 8-bit 1.65- to 5.5-V I2C/SMBus I/O expander with interrupt, & config registers; MF: Texas Instruments; SnapEDA_Link: https://www.snapeda.com/parts/TCA9534APWR/Texas+Instruments/view-part/?ref=snap; Package: TSSOP-16 Texas Instruments; Value: *; MP: TCA9534APWR; Check_prices: https://www.snapeda.com/parts/TCA9534APWR/Texas+Instruments/view-part/?ref=eda
U?#9 = MPRLS0025PA00001A: Pressure Sensor 25PSI _172.37kPa_ Absolute Male - 0.1 _2.5mm_ Tube 24 b 12-SMD Module; MF: Honeywell Sensing; MP: MPRLS0025PA00001A; SnapEDA_Link: https://www.snapeda.com/parts/MPRLS0025PA00001A/Honeywell%20Sensing%20and%20Productivity%20Solutions/view-part/2772767/?ref=snap; Digi-Key_Part_Number: 480-7098-1-ND; Package: SMD-10 Honeywell; Value: *